# EAGLE schematic base-6u-at91sam7s-eval-r2 (EAGLE 4.16)
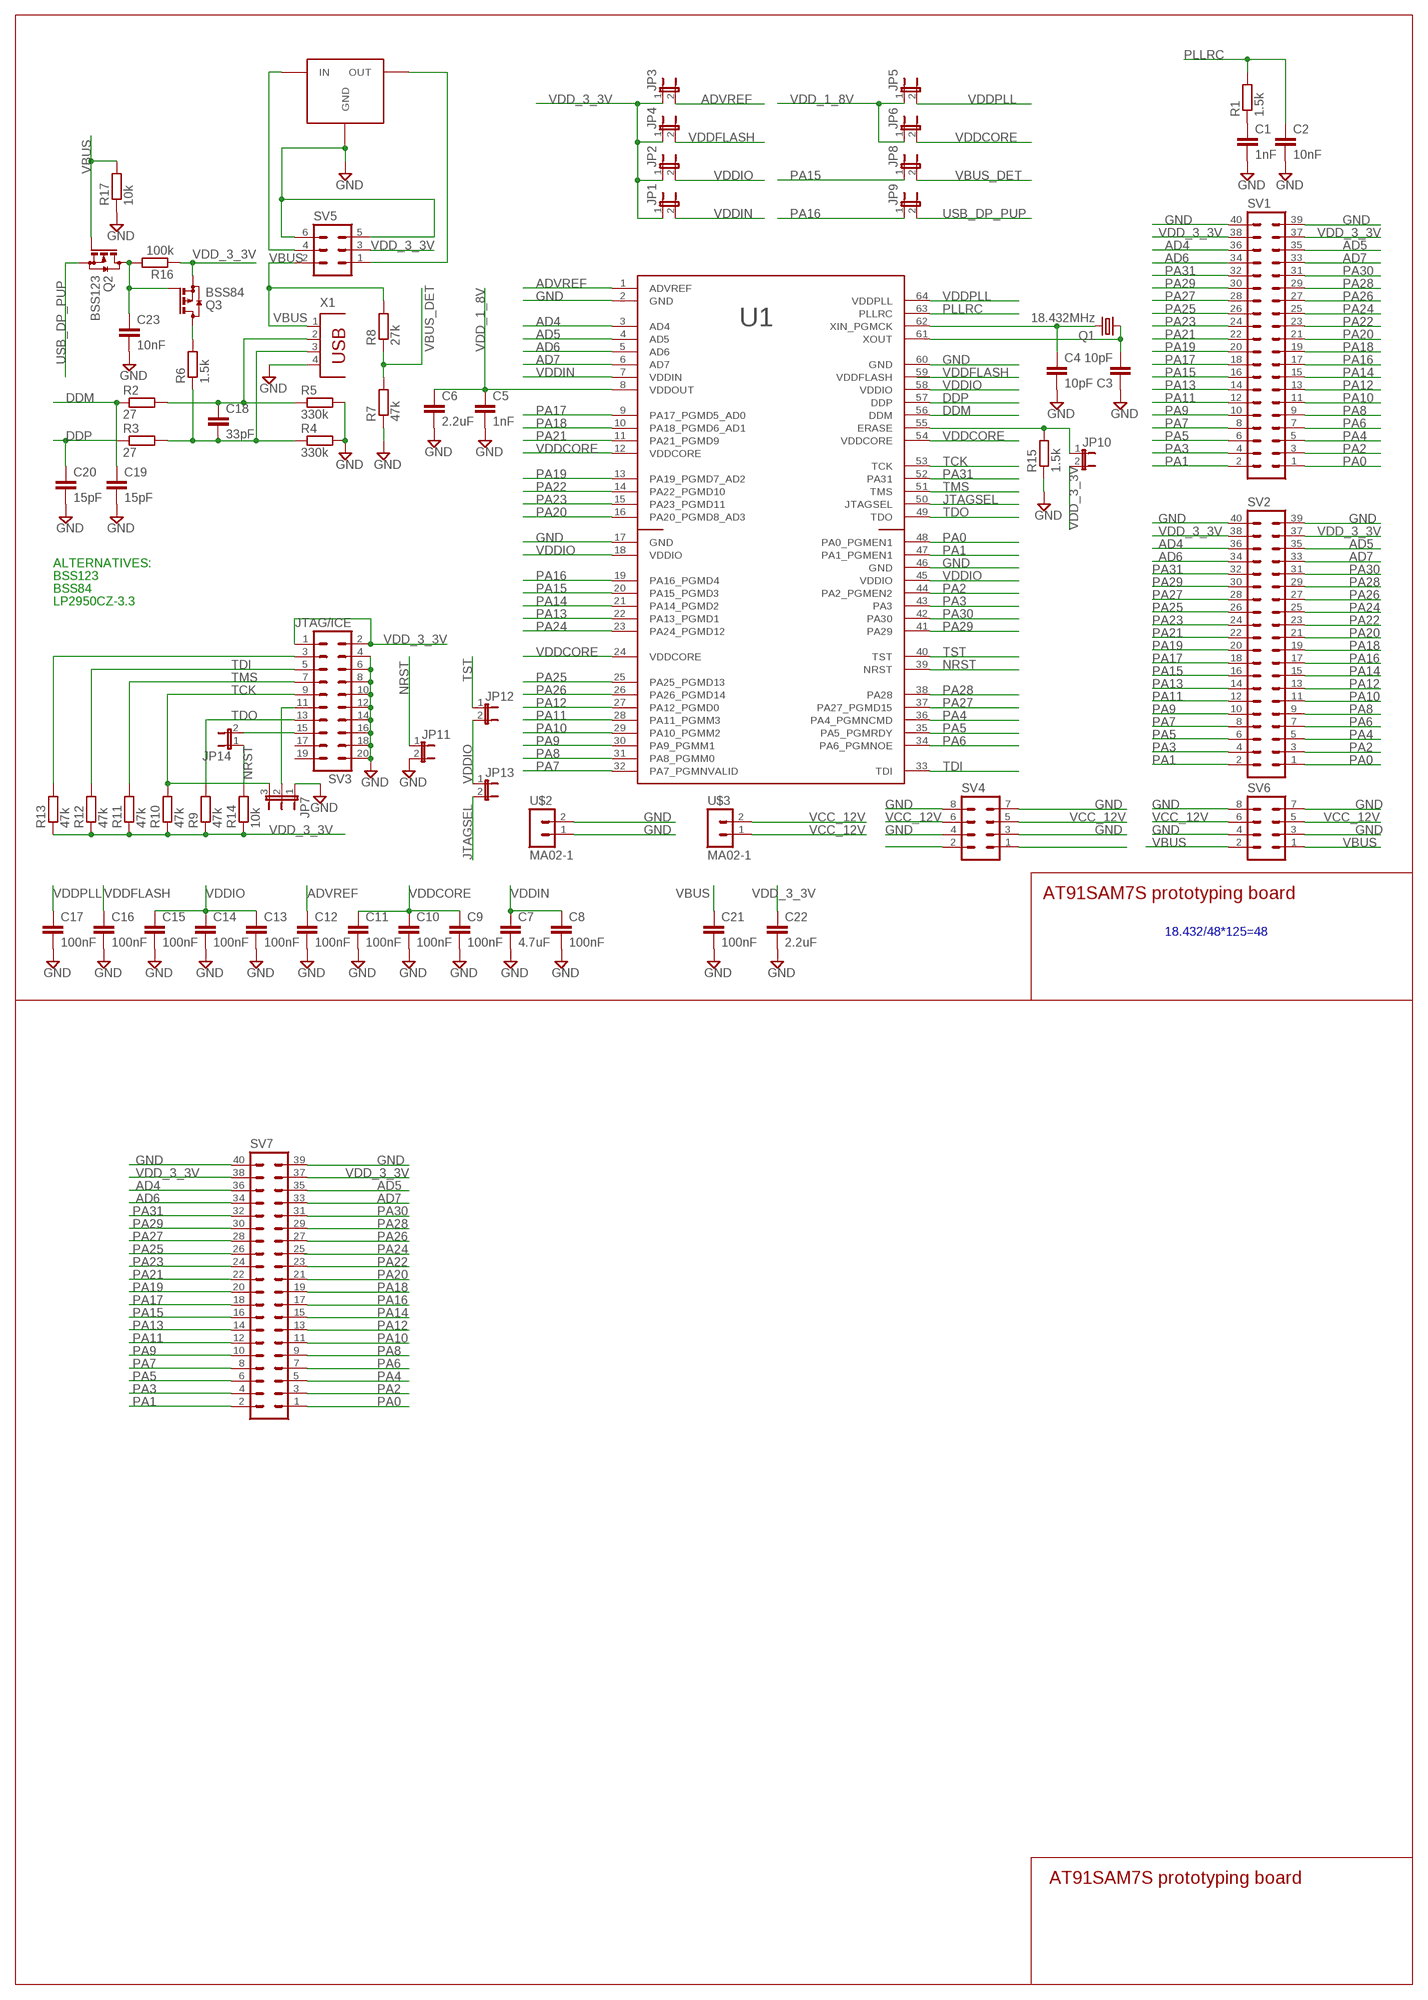
[diagram p0: schematic, sheet 1]

## Parts
C1  1nF  C-EUC0603  [C0603]
C2  10nF  C-EUC0603  [C0603]
C3  10pF  C-EUC0603  [C0603]
C4  10pF  C-EUC0603  [C0603]
C5  1nF  C-EUC0603  [C0603]
C6  2.2uF  C-EUC1206  [C1206]
C7  4.7uF  C-EUC1206  [C1206]
C8  100nF  C-EUC0603  [C0603]
C9  100nF  C-EUC0603  [C0603]
C10  100nF  C-EUC0603  [C0603]
C11  100nF  C-EUC0603  [C0603]
C12  100nF  C-EUC0603  [C0603]
C13  100nF  C-EUC0603  [C0603]
C14  100nF  C-EUC0603  [C0603]
C15  100nF  C-EUC0603  [C0603]
C16  100nF  C-EUC0603  [C0603]
C17  100nF  C-EUC0603  [C0603]
C18  33pF  C-EUC0603  [C0603]
C19  15pF  C-EUC0603  [C0603]
C20  15pF  C-EUC0603  [C0603]
C21  100nF  C-EUC0603  [C0603]
C22  2.2uF  C-EUC1206  [C1206]
C23  10nF  C-EUC0603  [C0603]
JP1  JP1E  [JP1]
JP2  JP1E  [JP1]
JP3  JP1E  [JP1]
JP4  JP1E  [JP1]
JP5  JP1E  [JP1]
JP6  JP1E  [JP1]
JP7  JP2E  [JP2]
JP8  JP1E  [JP1]
JP9  JP1E  [JP1]
JP10  JP1E  [JP1]
JP11  JP1E  [JP1]
JP12  JP1E  [JP1]
JP13  JP1E  [JP1]
JP14  JP1E  [JP1]
Q1  18.432MHz  CRYSTALHC49S  [HC49/S]
Q2  BSS123  [SOT23]
Q3  BSS84  [SOT23]
R1  1.5k  R-0603  [R0603]
R2  27  R-EU_R0603  [R0603]
R3  27  R-EU_R0603  [R0603]
R4  330k  R-EU_R0603  [R0603]
R5  330k  R-EU_R0603  [R0603]
R6  1.5k  R-EU_R0603  [R0603]
R7  47k  R-EU_R0603  [R0603]
R8  27k  R-EU_R0603  [R0603]
R9  47k  R-0603  [R0603]
R10  47k  R-0603  [R0603]
R11  47k  R-0603  [R0603]
R12  47k  R-0603  [R0603]
R13  47k  R-0603  [R0603]
R14  10k  R-0603  [R0603]
R15  1.5k  R-0603  [R0603]
R16  100k  R-EU_R0603  [R0603]
R17  10k  R-EU_R0603  [R0603]
SV1  MA20-2  [MA20-2]
SV2  MA20-2  [MA20-2]
SV3  JTAG/ICE  MA10-2W  [MA10-2W]
SV4  MA04-2  [MA04-2]
SV5  MA03-2  [MA03-2]
SV6  MA04-2  [MA04-2]
SV7  MA20-2  [MA20-2]
U1  AT91SAM7S64_LQFP64  [LQFP64]
U$1  LF33CDT  [TO-252]
U$2  MA02-1  [MA02-1]
U$3  MA02-1  [MA02-1]
X1  PN61729  [PN61729]

## Nets
AD4: SV1.36 SV2.36 SV7.36 U1.3(AD4)
AD5: SV1.35 SV2.35 SV7.35 U1.4(AD5)
AD6: SV1.34 SV2.34 SV7.34 U1.5(AD6)
AD7: SV1.33 SV2.33 SV7.33 U1.6(AD7)
ADVREF: C12.1 JP3.2 U1.1(ADVREF)
DDM: C19.1 R2.1 U1.56(DDM)
DDP: C20.1 R3.1 U1.57(DDP)
GND: C1.2 C2.2 C3.1 C4.2 C5.2 C6.2 C7.2 C8.2 C9.2 C10.2 C11.2 C12.2 C13.2 C14.2 C15.2 C16.2 C17.2 C19.2 C20.2 C21.2 C22.2 C23.2 JP7.1 JP11.2 R4.2 R5.2 R7.1 R15.1 R17.1 SV1.39 SV1.40 SV2.39 SV2.40 SV3.4 SV3.6 SV3.8 SV3.10 SV3.12 SV3.14 SV3.16 SV3.18 SV3.20 SV4.3 SV4.4 SV4.7 SV4.8 SV5.5 SV5.6 SV6.3 SV6.4 SV6.7 SV6.8 SV7.39 SV7.40 U1.2(GND) U1.17(GND) U1.46(GND) U1.60(GND) U$1.3(GND) U$2.1 U$2.2 X1.4
JTAGSEL: JP13.2 U1.50(JTAGSEL)
N$1: C4.1 Q1.2 U1.62(XIN_PGMCK)
N$2: C3.2 Q1.1 U1.61(XOUT)
N$3: C1.1 R1.1
N$4: C18.1 R2.2 R5.1 X1.2
N$5: C18.2 R3.2 R4.1 R6.1 X1.3
N$7: Q3.3(D) R6.2
N$9: JP14.2 SV3.15
N$11: SV5.4 U$1.1(IN)
N$12: SV5.1 U$1.2(OUT)
N$13: R13.2 SV3.3
N$15: JP10.1 R15.2 U1.55(ERASE)
N$16: JP7.2 SV3.11
N$17: C23.1 Q2.3(D) Q3.1(G) R16.2
NRST: JP11.1 JP14.1 R14.2 U1.39(NRST)
PA0: SV1.1 SV2.1 SV7.1 U1.48(PA0_PGMEN1)
PA1: SV1.2 SV2.2 SV7.2 U1.47(PA1_PGMEN1)
PA2: SV1.3 SV2.3 SV7.3 U1.44(PA2_PGMEN2)
PA3: SV1.4 SV2.4 SV7.4 U1.43(PA3)
PA4: SV1.5 SV2.5 SV7.5 U1.36(PA4_PGMNCMD)
PA5: SV1.6 SV2.6 SV7.6 U1.35(PA5_PGMRDY)
PA6: SV1.7 SV2.7 SV7.7 U1.34(PA6_PGMNOE)
PA7: SV1.8 SV2.8 SV7.8 U1.32(PA7_PGMNVALID)
PA8: SV1.9 SV2.9 SV7.9 U1.31(PA8_PGMM0)
PA9: SV1.10 SV2.10 SV7.10 U1.30(PA9_PGMM1)
PA10: SV1.11 SV2.11 SV7.11 U1.29(PA10_PGMM2)
PA11: SV1.12 SV2.12 SV7.12 U1.28(PA11_PGMM3)
PA12: SV1.13 SV2.13 SV7.13 U1.27(PA12_PGMD0)
PA13: SV1.14 SV2.14 SV7.14 U1.22(PA13_PGMD1)
PA14: SV1.15 SV2.15 SV7.15 U1.21(PA14_PGMD2)
PA15: JP8.1 SV1.16 SV2.16 SV7.16 U1.20(PA15_PGMD3)
PA16: JP9.1 SV1.17 SV2.17 SV7.17 U1.19(PA16_PGMD4)
PA17: SV1.18 SV2.18 SV7.18 U1.9(PA17_PGMD5_AD0)
PA18: SV1.19 SV2.19 SV7.19 U1.10(PA18_PGMD6_AD1)
PA19: SV1.20 SV2.20 SV7.20 U1.13(PA19_PGMD7_AD2)
PA20: SV1.21 SV2.21 SV7.21 U1.16(PA20_PGMD8_AD3)
PA21: SV1.22 SV2.22 SV7.22 U1.11(PA21_PGMD9)
PA22: SV1.23 SV2.23 SV7.23 U1.14(PA22_PGMD10)
PA23: SV1.24 SV2.24 SV7.24 U1.15(PA23_PGMD11)
PA24: SV1.25 SV2.25 SV7.25 U1.23(PA24_PGMD12)
PA25: SV1.26 SV2.26 SV7.26 U1.25(PA25_PGMD13)
PA26: SV1.27 SV2.27 SV7.27 U1.26(PA26_PGMD14)
PA27: SV1.28 SV2.28 SV7.28 U1.37(PA27_PGMD15)
PA28: SV1.29 SV2.29 SV7.29 U1.38(PA28)
PA29: SV1.30 SV2.30 SV7.30 U1.41(PA29)
PA30: SV1.31 SV2.31 SV7.31 U1.42(PA30)
PA31: SV1.32 SV2.32 SV7.32 U1.52(PA31)
PLLRC: C2.1 R1.2 U1.63(PLLRC)
TCK: JP7.3 R10.2 SV3.9 U1.53(TCK)
TDI: R12.2 SV3.5 U1.33(TDI)
TDO: R9.2 SV3.13 U1.49(TDO)
TMS: R11.2 SV3.7 U1.51(TMS)
TST: JP12.1 U1.40(TST)
USB_DP_PUP: JP9.2 Q2.2(S)
VBUS: C21.1 Q2.1(G) R8.2 R17.2 SV4.1 SV4.2 SV5.2 SV6.1 SV6.2 X1.1
VBUS_DET: JP8.2 R7.2 R8.1
VCC_12V: SV4.5 SV4.6 SV6.5 SV6.6 U$3.1 U$3.2
VDD_1_8V: C5.1 C6.1 JP5.1 JP6.1 U1.8(VDDOUT)
VDD_3_3V: C22.1 JP1.1 JP2.1 JP3.1 JP4.1 JP10.2 Q3.2(S) R9.1 R10.1 R11.1 R12.1 R13.1 R14.1 R16.1 SV1.37 SV1.38 SV2.37 SV2.38 SV3.1 SV3.2 SV5.3 SV7.37 SV7.38
VDDCORE: C9.1 C10.1 C11.1 JP6.2 U1.12(VDDCORE) U1.24(VDDCORE) U1.54(VDDCORE)
VDDFLASH: C16.1 JP4.2 U1.59(VDDFLASH)
VDDIN: C7.1 C8.1 JP1.2 U1.7(VDDIN)
VDDIO: C13.1 C14.1 C15.1 JP2.2 JP12.2 JP13.1 U1.18(VDDIO) U1.45(VDDIO) U1.58(VDDIO)
VDDPLL: C17.1 JP5.2 U1.64(VDDPLL)
Unconnected: SV3.17 SV3.19

## Notes on the sheet
- ALTERNATIVES:
- BSS123
- BSS84
- LP2950CZ-3.3
- AT91SAM7S prototyping board
- 18.432/48*125=48
- AT91SAM7S prototyping board

## Library data of the parts
C1-C23 = rcl:C-EU: CAPACITOR, European symbol
JP1-JP6 JP8-JP14 = jumper:JP1E: JUMPER
JP7 = jumper:JP2E: JUMPER
Q1 = crystal:CRYSTAL: CRYSTAL
Q2 = transistor-small-signal:BSS123: N-CHANNEL MOS FET
Q3 = transistor-small-signal:BSS84: P-CHANNEL MOS FET
R1 R9-R15 = quantum-sensor:R: Resistor
R2-R8 R16 R17 = rcl:R-EU_: RESISTOR, European symbol
SV1 SV2 SV7 = con-lstb:MA20-2: PIN HEADER
SV3 = con-lstb:MA10-2W: PIN HEADER
SV4 SV6 = con-lstb:MA04-2: PIN HEADER
SV5 = con-lstb:MA03-2: PIN HEADER
U1 = Atmel_Prototype_Header:AT91SAM7S64: Atmel AT91 ARM Thumb-based Microcontroller. LQFP64 package.
U$1 = my-to252:LF33CDT
U$2 U$3 = cls:MA02-1
X1 = con-berg:PN61729: BERG USB connector